# EAGLE design Sens_HIH613x (EAGLE 6.4)
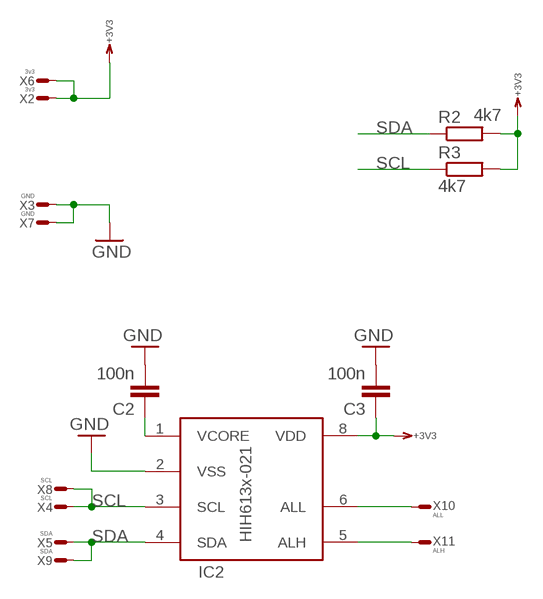
[diagram p0: schematic, sheet 1]

## Parts
C2  100n  C0603  [0603]
C3  100n  C0603  [0603]
IC2  HIH613x-021  HIH613X  [SO8]
R2  4k7  R0603  [0603]
R3  4k7  R0603  [0603]
X2  3v3  WIREPADT1.6/0.9  [T1.6/0.9]
X3  GND  WIREPADT1.6/0.9  [T1.6/0.9]
X4  SCL  WIREPADT1.6/0.9  [T1.6/0.9]
X5  SDA  WIREPADT1.6/0.9  [T1.6/0.9]
X6  3v3  WIREPADT1.6/0.9  [T1.6/0.9]
X7  GND  WIREPADT1.6/0.9  [T1.6/0.9]
X8  SCL  WIREPADT1.6/0.9  [T1.6/0.9]
X9  SDA  WIREPADT1.6/0.9  [T1.6/0.9]
X10  ALL  WIREPADR  [S1.27R]
X11  ALH  WIREPADR  [S1.27R]

## Nets
+3V3: C3.1 IC2.8(VDD) R2.2 R3.2 X2.1(S) X6.1(S)
ALH: IC2.5(ALH) X11.1(S)
ALL: IC2.6(ALL) X10.1(S)
GND: C2.2 C3.2 IC2.2(VSS) X3.1(S) X7.1(S)
N$1: C2.1 IC2.1(VCORE)
SCL: IC2.3(SCL) R3.1 X4.1(S) X8.1(S)
SDA: IC2.4(SDA) R2.1 X5.1(S) X9.1(S)

## Library data of the parts
C2 C3 = RCL:C: Capacitor SMD
IC2 = Sensors:HIH613X
R2 R3 = RCL:R: Resistor SMD
X2-X11 = Conn:WIREPAD: Wire PAD connect wire on PCB

## Board
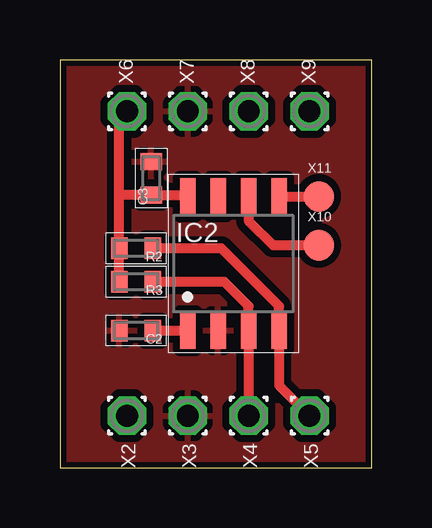
[diagram p1: board, top side]
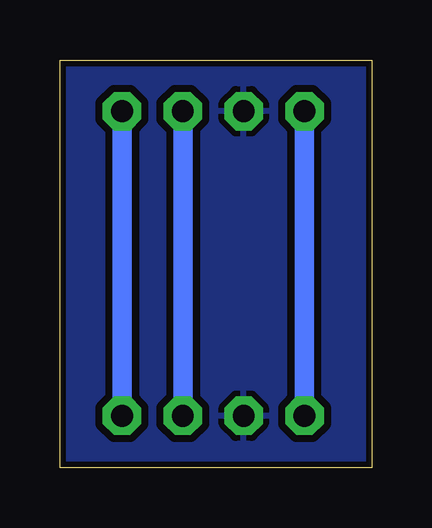
[diagram p2: board, bottom side, seen from below]

Size 13 x 17 mm. Coordinates in mm from the lower left corner, seen from the top.
Outline: 0,0 13,0 13,17 0,17 0,0
Copper layers (1*16): Top 0.035mm / dielectric 1.5mm / Bottom 0.035mm
Design rules "default": minimum track width 10mil, minimum drill 12mil, track to track 12mil, track to pad 12mil, pad to pad 12mil, via to via 12mil, smd to smd 12mil, copper to edge 10mil, drill to drill 8mil, minimum pad ring 10mil, minimum via ring 8mil, stop-mask expansion 4mil, vias tented up to drill 0mil, thermal gap 10mil

### Footprints (pad centres in the part's own frame; a part is rotated, then mirrored left to right if it is on the bottom)
0603 = smd 0.7 x 0.9: 1 -0.697,0; 2 0.697,0
SO8 = smd 0.635 x 1.524: 1 -1.905,-2.794; 2 -0.635,-2.794; 3 0.635,-2.794; 4 1.905,-2.794; 5 1.905,2.794; 6 0.635,2.794; 7 -0.635,2.794; 8 -1.905,2.794
T1.6/0.9 = drill 0.914 pad 1.6 octagon: 1 0,0
S1.27R = smd 1.27 x 1.27: 1 0,0

### Placement (x,y rotation side)
C2  3.17,5.71 180 top
C3  3.81,12.06 90 top
IC2  7.24,8.51 0 top
R2  3.17,9.14 180 top
R3  3.17,7.75 180 top
X2  2.79,2.16 270 top
X3  5.33,2.16 270 top
X4  7.87,2.16 270 top
X5  10.41,2.16 270 top
X6  2.79,14.86 90 top
X7  5.33,14.86 90 top
X8  7.87,14.86 90 top
X9  10.41,14.86 90 top
X10  10.79,9.27 0 top
X11  10.79,11.3 0 top

### Tracks (layer width: path | path; a pad name or v marks a point on that pad's centre or on a via)
+3V3
  Top 0.406: IC2.8 5.27,11.37 C3.1 2.54,11.37 2.48,11.3 | 2.48,11.3 R2.2 R3.2 | 2.48,11.3 2.48,14.54 X6.1
  Bottom 0.813: X2.1 X6.1
ALH
  Top 0.406: IC2.5 X11.1
ALL
  Top 0.406: IC2.6 7.87,10.29 8.89,9.27 X10.1
GND
  pour Top: 0,17 13,17 13,0 0,0
  pour Bottom: 0,0 13,0 13,17 0,17
N$1
  Top 0.406: C2.1 IC2.1
SCL
  Top 0.406: X4.1 IC2.3 7.87,6.73 6.86,7.75 R3.1
  Bottom 0.813: X8.1 X4.1
SDA
  Top 0.406: R2.1 6.73,9.14 9.14,6.73 IC2.4 9.14,3.43 X5.1
  Bottom 0.813: X9.1 X5.1